# Altium schematic sheet Topview.SchDoc
size A4
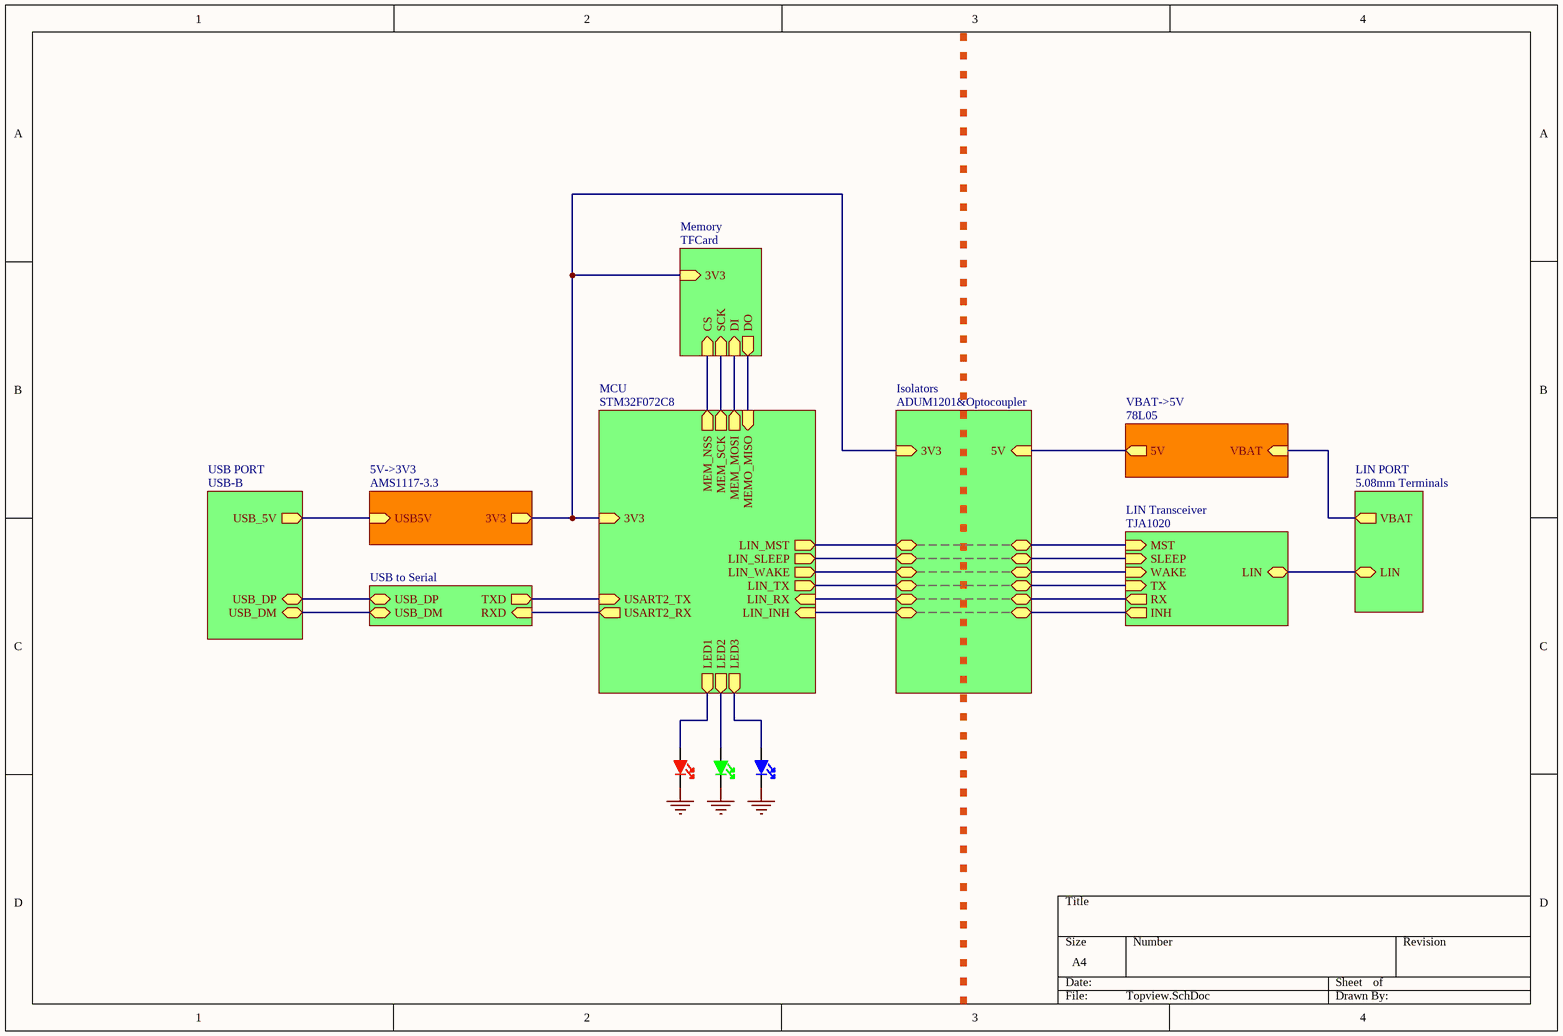
[diagram p0: Topview.SchDoc]

## Parts
(Parts that share a designator on the sheet are numbered #1, #2 ... from top to bottom, then left to right.)
?#1  LED_RED  [LED3]  (value not drawn)
?#2  LED_GREEG  [LED3]  (value not drawn)
?#3  LED_RED  [LED3]  (value not drawn)

## Sub-sheets
5V->3V3 = AMS1117-3.3: USB5V (in), 3V3 (out)
Isolators = ADUM1201&Optocoupler: 3V3 (in), 5V (in), , , , , , , , , , , , 
LIN PORT = 5.08mm Terminals: VBAT (out), LIN
LIN Transceiver = TJA1020: LIN, TX (in), RX (out), SLEEP (in), WAKE (in), INH (out), MST (in)
MCU = STM32F072C8: USART2_TX, USART2_RX, LIN_TX (out), LIN_RX (in), LIN_SLEEP (out), LIN_WAKE (out), LIN_INH (in), MEM_NSS (out), MEM_SCK (out), MEM_MOSI (out), MEMO_MISO (in), LED1 (out), LED2 (out), LED3 (out), LIN_MST (out), 3V3 (in)
Memory = TFCard: CS (in), DI (in), SCK (in), DO (out), 3V3 (in)
USB PORT = USB-B: USB_DM, USB_DP, USB_5V (out)
USB to Serial = ?: USB_DP, TXD, RXD, USB_DM
VBAT->5V = 78L05: VBAT (in), 5V (out)

## Nets
Net?#1_K: ?#1.K(k) ?#2.K(k) ?#3.K(k)
Net?#1_A: ?#1.A(a) ; sheet MCU/LED1
Net?#2_A: ?#2.A(a) ; sheet MCU/LED2
Net?#3_A: ?#3.A(a) ; sheet MCU/LED3
(unnamed): sheet USB PORT/USB_DM, sheet USB to Serial/USB_DM
(unnamed): sheet USB PORT/USB_DP, sheet USB to Serial/USB_DP
(unnamed): sheet USB PORT/USB_5V, sheet 5V->3V3/USB5V
(unnamed): sheet 5V->3V3/3V3, sheet MCU/3V3, sheet Memory/3V3, sheet Isolators/3V3
(unnamed): sheet USB to Serial/TXD, sheet MCU/USART2_TX
(unnamed): sheet USB to Serial/RXD, sheet MCU/USART2_RX
(unnamed): sheet LIN Transceiver/LIN, sheet LIN PORT/LIN
(unnamed): sheet LIN Transceiver/TX, sheet Isolators/
(unnamed): sheet LIN Transceiver/RX, sheet Isolators/
(unnamed): sheet LIN Transceiver/SLEEP, sheet Isolators/
(unnamed): sheet LIN Transceiver/WAKE, sheet Isolators/
(unnamed): sheet LIN Transceiver/INH, sheet Isolators/
(unnamed): sheet LIN Transceiver/MST, sheet Isolators/
(unnamed): sheet MCU/LIN_TX, sheet Isolators/
(unnamed): sheet MCU/LIN_RX, sheet Isolators/
(unnamed): sheet MCU/LIN_SLEEP, sheet Isolators/
(unnamed): sheet MCU/LIN_WAKE, sheet Isolators/
(unnamed): sheet MCU/LIN_INH, sheet Isolators/
(unnamed): sheet MCU/MEM_NSS, sheet Memory/CS
(unnamed): sheet MCU/MEM_SCK, sheet Memory/SCK
(unnamed): sheet MCU/MEM_MOSI, sheet Memory/DI
(unnamed): sheet MCU/MEMO_MISO, sheet Memory/DO
(unnamed): sheet MCU/LIN_MST, sheet Isolators/
(unnamed): sheet LIN PORT/VBAT, sheet VBAT->5V/VBAT
(unnamed): sheet VBAT->5V/5V, sheet Isolators/5V

## Library data of the parts
?#1 = LED-R
?#2 = LED-G
?#3 = LED-B